# EAGLE board picotouch_grid_mpr (EAGLE 9.6.2)
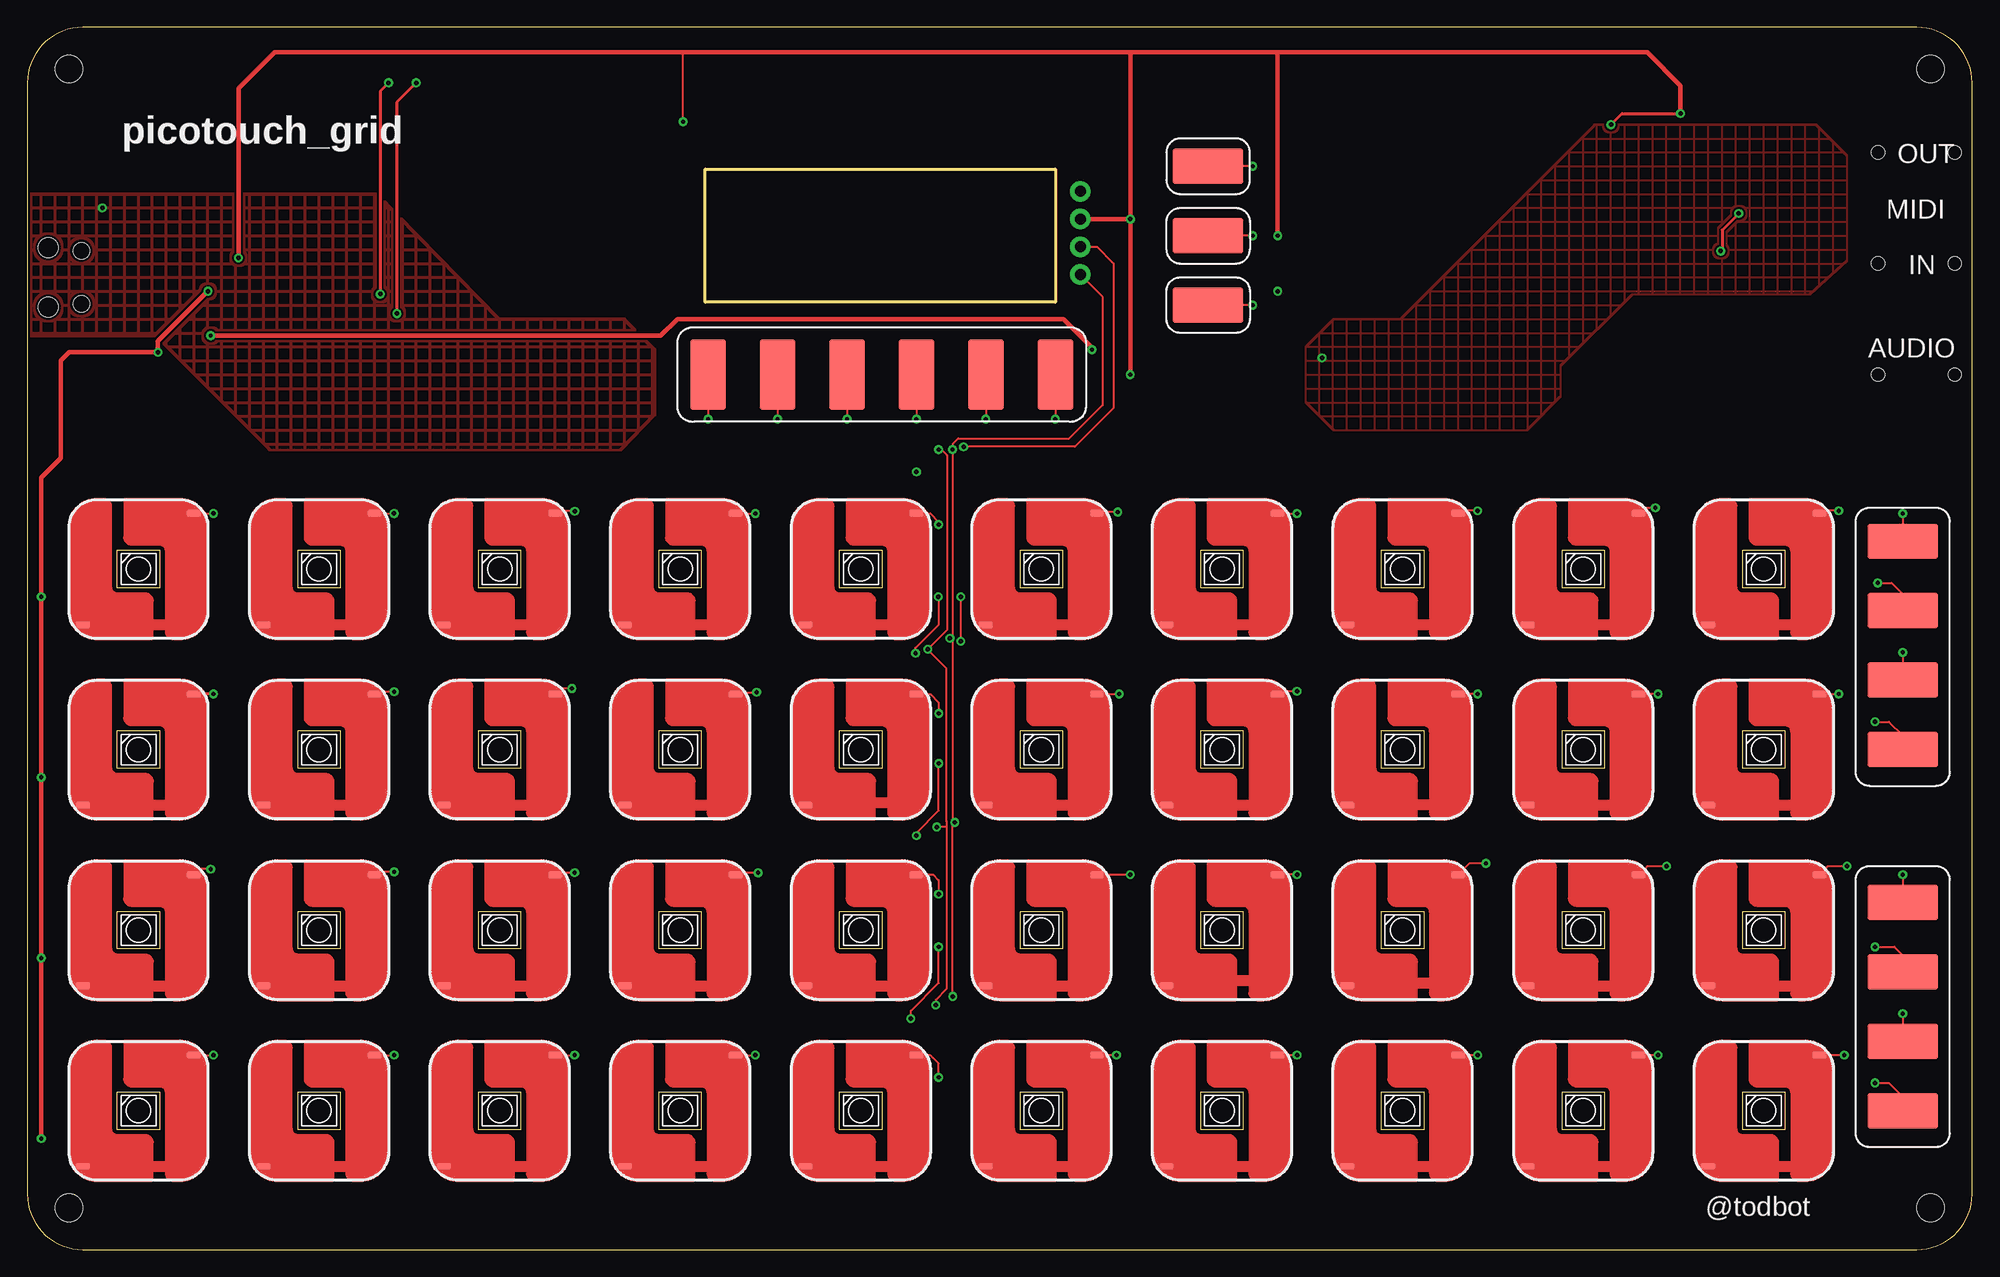
[diagram p2: board, top side]
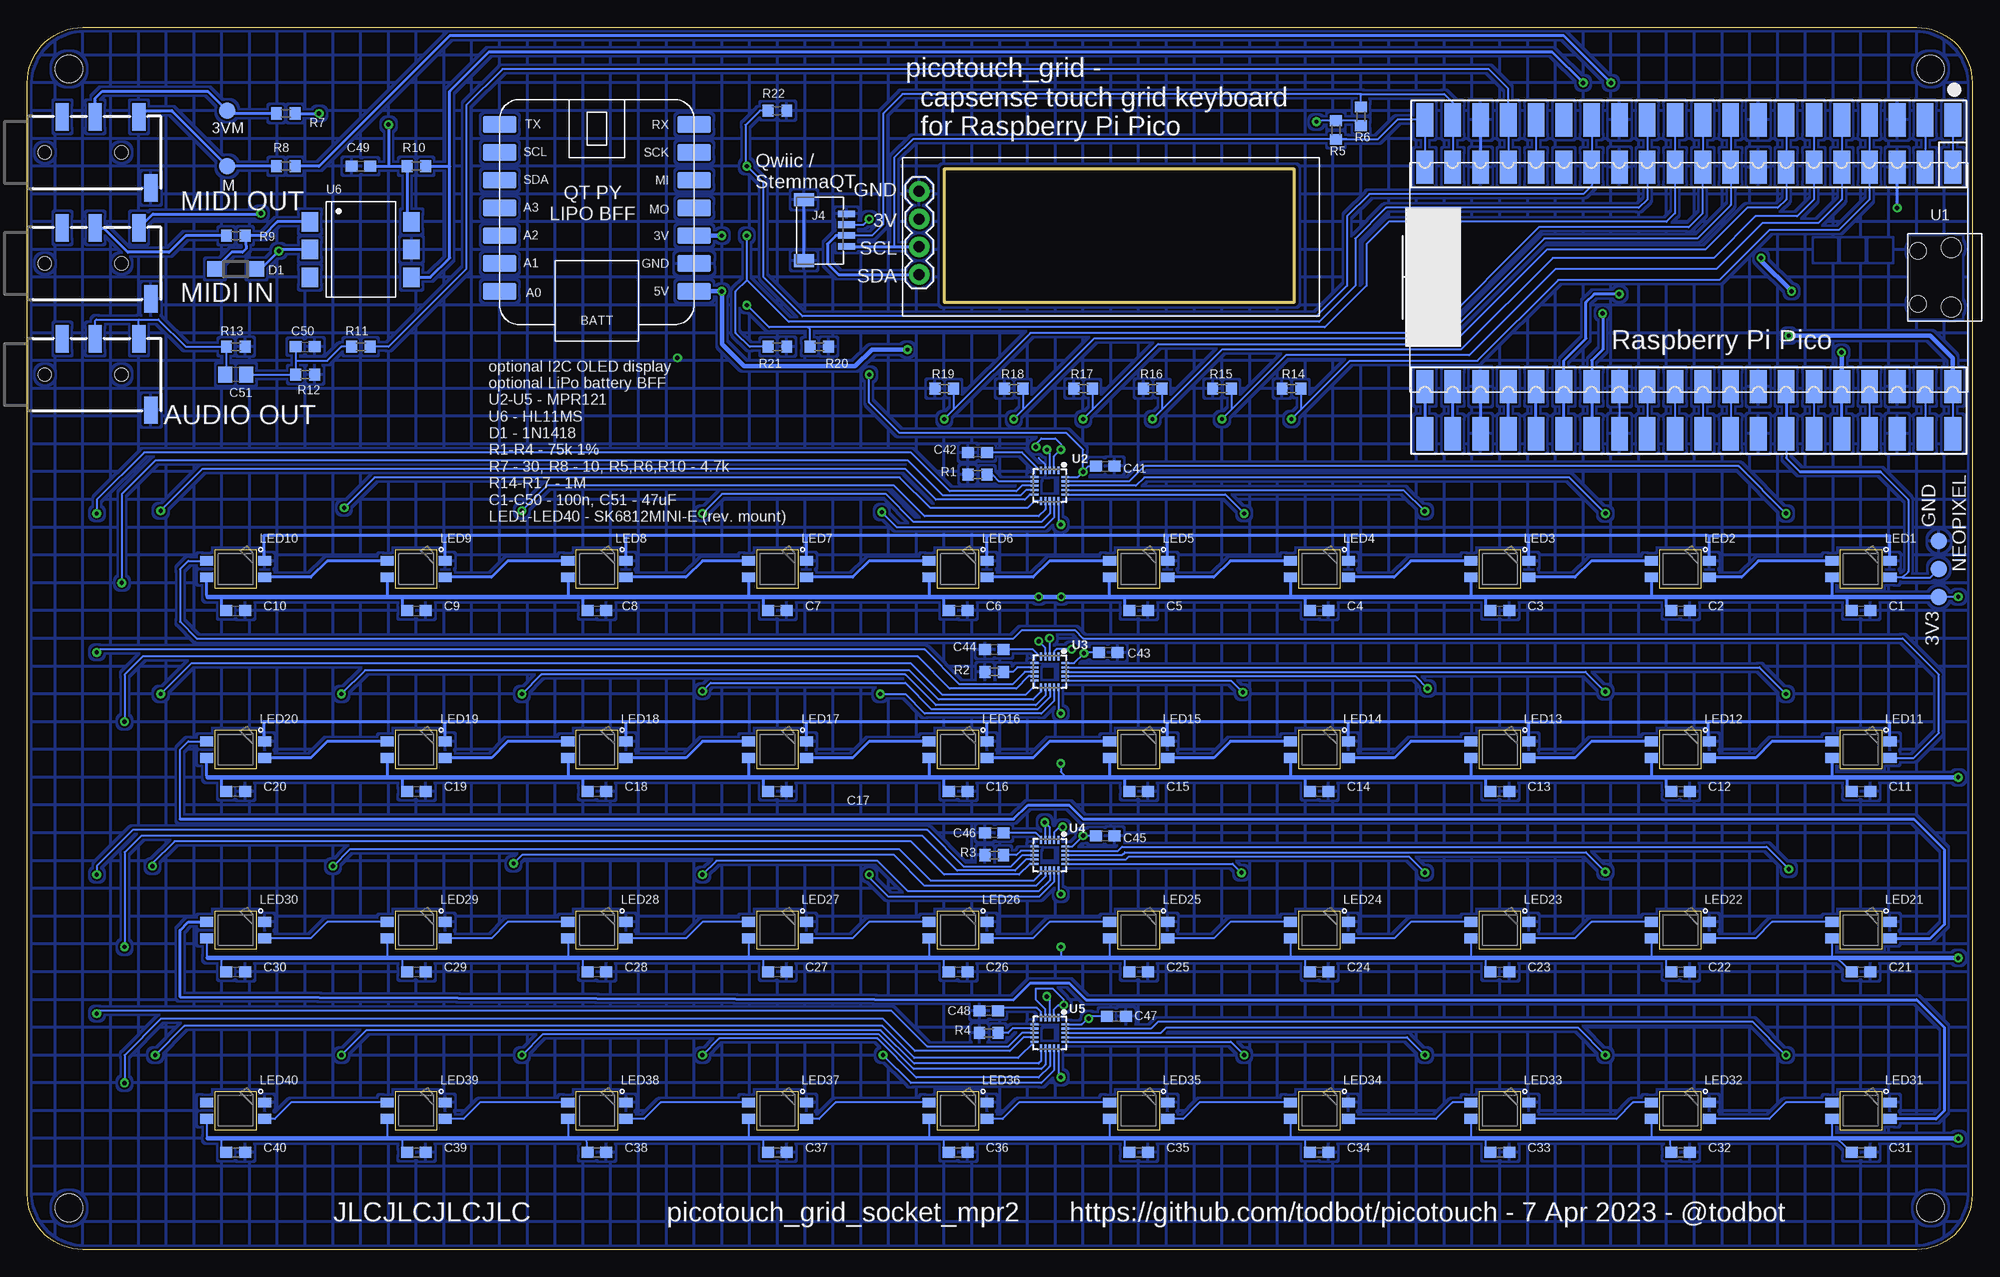
[diagram p3: board, bottom side, seen from below]

Size 177.8 x 111.76 mm. Coordinates in mm from the lower left corner, seen from the top.
Outline: 5.08,0 172.72,0 arc90 177.8,5.08 177.8,106.68 arc90 172.72,111.76 5.08,111.76 arc90 0,106.68 0,5.08 arc90 5.08,0
Outline: 61.98,98.81 93.98,98.81 93.98,86.61 61.98,86.61 61.98,98.81
Copper layers (1*16): Top 0.035mm / dielectric 1.5mm / Bottom 0.035mm
Design rules "adafruit-mpr-hat": minimum track width 7mil, minimum drill 15.5mil, track to track 7mil, track to pad 7mil, pad to pad 7mil, via to via 8mil, smd to smd 8mil, copper to edge 10mil, drill to drill 8mil, minimum pad ring 10mil, minimum via ring 8mil, stop-mask expansion 2mil, vias tented up to drill 20mil, thermal gap 10mil
Holes 2.54 mm at 3.81,107.95 173.99,107.95 173.99,3.81 3.81,3.81

## Footprints (pad centres in the part's own frame; a part is rotated, then mirrored left to right if it is on the bottom)
TP15R = smd 1.5 x 1.5: TP 0,0
C0603 = smd 1.1 x 1: 1 -0.85,0; 2 0.85,0
C0805 = smd 1.3 x 1.5: 1 -0.95,0; 2 0.95,0
SOD123 = smd 1.4 x 1.4: A 1.9,0; C -1.9,0
1X04 = drill 1.016 pad 1.88: 1 0,0; 2 2.54,0; 3 5.08,0; 4 7.62,0
PJ-320D_SPARKFUN = smd 1.2 x 2.5: EARTH 11.3,-3.25; RING1 6.2,3.25; RING2 3.2,3.25; TIP 10.2,3.25 | hole 1.2: 1.6,0; 8.6,0
JST_SH4 = smd 0.6 x 1.55: 1 -1.5,2.006; 2 -0.5,2.006; 3 0.5,2.006; 4 1.5,2.006 | smd 1.2 x 1.8: MT1 -2.8,-1.894; MT2 2.8,-1.894
TOUCHPAD_KEY_0.5IN_LEDHOLE = smd 1.27 x 0.635: T1 -5.08,-5.08; T2 5.08,5.08
MICROBUILDER_NEO3535_REVERSE = smd 1.2 x 0.9 bottom: 1-VDD 2.65,-0.75; 2-DOUT 2.65,0.75; 3-GND -2.65,0.75; 4-DIN -2.65,-0.75
R0603 = smd 1 x 1.1: 1 -0.85,0; 2 0.85,0
TOUCHPADB = smd 6.452 x 3.251: TP 0,0
PICO-PKG-DUALSMD = smd 3.048 x 1.524: 1 -10.078,24.142; 1' -14.396,24.142; 2 -10.078,21.602; 2' -14.396,21.602; 3 -10.078,19.062; 3' -14.396,19.062; 4 -10.078,16.522; 4' -14.396,16.522; 5 -10.078,13.982; 5' -14.396,13.982; 6 -10.078,11.442; 6' -14.396,11.442; 7 -10.078,8.902; 7' -14.396,8.902; 8 -10.078,6.362; 8' -14.396,6.362; 9 -10.078,3.822; 9' -14.396,3.822; 10 -10.078,1.282; 10' -14.396,1.282; 11 -10.078,-1.258; 11' -14.396,-1.258; 12 -10.078,-3.798; 12' -14.396,-3.798; 13 -10.078,-6.338; 13' -14.396,-6.338; 14 -10.078,-8.878; 14' -14.396,-8.878; 15 -10.078,-11.418; 15' -14.396,-11.418; 16 -10.078,-13.958; 16' -14.396,-13.958; 17 -10.078,-16.498; 17' -14.396,-16.498; 18 -10.078,-19.038; 18' -14.396,-19.038; 19 -10.078,-21.578; 19' -14.396,-21.578; 20 -10.078,-24.118; 20' -14.396,-24.118; 21 9.988,-24.118; 21' 14.306,-24.118; 22 9.988,-21.578; 22' 14.306,-21.578; 23 9.988,-19.038; 23' 14.306,-19.038; 24 9.988,-16.498; 24' 14.306,-16.498; 25 9.988,-13.958; 25' 14.306,-13.958; 26 9.988,-11.418; 26' 14.306,-11.418; 27 9.988,-8.878; 27' 14.306,-8.878; 28 9.988,-6.338; 28' 14.306,-6.338; 29 9.988,-3.798; 29' 14.306,-3.798; 30 9.988,-1.258; 30' 14.306,-1.258; 31 9.988,1.282; 31' 14.306,1.282; 32 9.988,3.822; 32' 14.306,3.822; 33 9.988,6.362; 33' 14.306,6.362; 34 9.988,8.902; 34' 14.306,8.902; 35 9.988,11.442; 35' 14.306,11.442; 36 9.988,13.982; 36' 14.306,13.982; 37 9.988,16.522; 37' 14.306,16.522; 38 9.988,19.062; 38' 14.306,19.062; 39 9.988,21.602; 39' 14.306,21.602; 40 9.988,24.142; 40' 14.306,24.142 | hole 1.8: -2.725,24; 2.725,24 | hole 1.5: -2.425,20.97; 2.425,20.97
QFN20_3MM_NOTHERMAL = smd 0.7 x 0.2: 1 -1.4,0.8; 2 -1.4,0.4; 3 -1.4,0; 4 -1.4,-0.4; 5 -1.4,-0.8; 11 1.4,-0.8; 12 1.4,-0.4; 13 1.4,0; 14 1.4,0.4; 15 1.4,0.8 | smd 0.2 x 0.7: 6 -0.8,-1.4; 7 -0.4,-1.4; 8 0,-1.4; 9 0.4,-1.4; 10 0.8,-1.4; 16 0.8,1.4; 17 0.4,1.4; 18 0,1.4; 19 -0.4,1.4; 20 -0.8,1.4
DIL6-SMD = smd 1.78 x 1.52: 1 -2.54,-4.645; 2 0,-4.645; 3 2.54,-4.645; 4 2.54,4.645; 5 0,4.645; 6 -2.54,4.645
ADAFRUIT_QTPY_BFF_LIPO = smd 3.048 x 1.524: 3V -8.89,2.54; 5V -8.89,7.62; A0 8.89,7.62; A1 8.89,5.08; A2 8.89,2.54; A3 8.89,0; GND -8.89,5.08; MI -8.89,-2.54; MO -8.89,0; RX -8.89,-7.62; SCK -8.89,-5.08; SCL 8.89,-5.08; SDA 8.89,-2.54; TX 8.89,-7.62

## Placement (x,y rotation side)
3V3  TPTP15R  [TP15R]  3.05,59.69 0 bottom
3VM  TPTP15R  [TP15R]  159.51,104.14 180 bottom
C1  100n  [C0603]  10.16,58.42 0 bottom
C2  100n  [C0603]  26.67,58.42 0 bottom
C3  100n  [C0603]  43.18,58.42 0 bottom
C4  100n  [C0603]  59.69,58.42 0 bottom
C5  100n  [C0603]  76.2,58.42 0 bottom
C6  100n  [C0603]  92.71,58.42 0 bottom
C7  100n  [C0603]  109.22,58.42 0 bottom
C8  100n  [C0603]  125.73,58.42 0 bottom
C9  100n  [C0603]  142.24,58.42 0 bottom
C10  100n  [C0603]  158.75,58.42 0 bottom
C11  100n  [C0603]  10.16,41.91 0 bottom
C12  100n  [C0603]  26.67,41.91 0 bottom
C13  100n  [C0603]  43.18,41.91 0 bottom
C14  100n  [C0603]  59.69,41.91 0 bottom
C15  100n  [C0603]  76.2,41.91 0 bottom
C16  100n  [C0603]  92.71,41.91 0 bottom
C17  100n  [C0603]  109.22,41.91 0 bottom
C18  100n  [C0603]  125.73,41.91 0 bottom
C19  100n  [C0603]  142.24,41.91 0 bottom
C20  100n  [C0603]  158.75,41.91 0 bottom
C21  100n  [C0603]  10.16,25.4 0 bottom
C22  100n  [C0603]  26.67,25.4 0 bottom
C23  100n  [C0603]  43.18,25.4 0 bottom
C24  100n  [C0603]  59.69,25.4 0 bottom
C25  100n  [C0603]  76.2,25.4 0 bottom
C26  100n  [C0603]  92.71,25.4 0 bottom
C27  100n  [C0603]  109.22,25.4 0 bottom
C28  100n  [C0603]  125.73,25.4 0 bottom
C29  100n  [C0603]  142.24,25.4 0 bottom
C30  100n  [C0603]  158.75,25.4 0 bottom
C31  100n  [C0603]  10.16,8.89 0 bottom
C32  100n  [C0603]  26.67,8.89 0 bottom
C33  100n  [C0603]  43.18,8.89 0 bottom
C34  100n  [C0603]  59.69,8.89 0 bottom
C35  100n  [C0603]  76.2,8.89 0 bottom
C36  100n  [C0603]  92.71,8.89 0 bottom
C37  100n  [C0603]  109.22,8.89 0 bottom
C38  100n  [C0603]  125.73,8.89 0 bottom
C39  100n  [C0603]  142.24,8.89 0 bottom
C40  100n  [C0603]  158.75,8.89 0 bottom
C41  100n  [C0603]  79.25,71.63 0 bottom
C42  100n  [C0603]  90.93,72.9 180 bottom
C43  100n  [C0603]  78.99,54.61 0 bottom
C44  100n  [C0603]  89.41,54.86 180 bottom
C45  100n  [C0603]  79.25,37.85 0 bottom
C46  100n  [C0603]  89.41,38.1 180 bottom
C47  100n  [C0603]  78.23,21.34 0 bottom
C48  100n  [C0603]  89.92,21.84 180 bottom
C49  100n  [C0603]  147.32,99.06 180 bottom
C50  100n  [C0603]  152.4,82.55 0 bottom
C51  47uF  [C0805]  158.75,80.01 180 bottom
D1  1N4148  [SOD123]  158.75,89.66 0 bottom
DISP1  [1X04]  96.27,96.77 270 bottom
GND  TPTP15R  [TP15R]  3.05,64.77 0 bottom
J1  AUDIO-JACK-TRRS  [PJ-320D_SPARKFUN]  177.8,100.33 0 bottom
J2  AUDIO-JACK-TRRS  [PJ-320D_SPARKFUN]  177.8,90.17 0 bottom
J3  AUDIO-JACK-TRRS  [PJ-320D_SPARKFUN]  177.8,80.01 0 bottom
J4  STEMMA_I2C_QT  [JST_SH4]  104.9,93.22 270 bottom
K1  TOUCHKEYH  [TOUCHPAD_KEY_0.5IN_LEDHOLE]  10.16,62.23 0 top
K2  TOUCHKEYH  [TOUCHPAD_KEY_0.5IN_LEDHOLE]  26.67,62.23 0 top
K3  TOUCHKEYH  [TOUCHPAD_KEY_0.5IN_LEDHOLE]  43.18,62.23 0 top
K4  TOUCHKEYH  [TOUCHPAD_KEY_0.5IN_LEDHOLE]  59.69,62.23 0 top
K5  TOUCHKEYH  [TOUCHPAD_KEY_0.5IN_LEDHOLE]  76.2,62.23 0 top
K6  TOUCHKEYH  [TOUCHPAD_KEY_0.5IN_LEDHOLE]  92.71,62.23 0 top
K7  TOUCHKEYH  [TOUCHPAD_KEY_0.5IN_LEDHOLE]  109.22,62.23 0 top
K8  TOUCHKEYH  [TOUCHPAD_KEY_0.5IN_LEDHOLE]  125.73,62.23 0 top
K9  TOUCHKEYH  [TOUCHPAD_KEY_0.5IN_LEDHOLE]  142.24,62.23 0 top
K10  TOUCHKEYH  [TOUCHPAD_KEY_0.5IN_LEDHOLE]  158.75,62.23 0 top
K11  TOUCHKEYH  [TOUCHPAD_KEY_0.5IN_LEDHOLE]  10.16,45.72 0 top
K12  TOUCHKEYH  [TOUCHPAD_KEY_0.5IN_LEDHOLE]  26.67,45.72 0 top
K13  TOUCHKEYH  [TOUCHPAD_KEY_0.5IN_LEDHOLE]  43.18,45.72 0 top
K14  TOUCHKEYH  [TOUCHPAD_KEY_0.5IN_LEDHOLE]  59.69,45.72 0 top
K15  TOUCHKEYH  [TOUCHPAD_KEY_0.5IN_LEDHOLE]  76.2,45.72 0 top
K16  TOUCHKEYH  [TOUCHPAD_KEY_0.5IN_LEDHOLE]  92.71,45.72 0 top
K17  TOUCHKEYH  [TOUCHPAD_KEY_0.5IN_LEDHOLE]  109.22,45.72 0 top
K18  TOUCHKEYH  [TOUCHPAD_KEY_0.5IN_LEDHOLE]  125.73,45.72 0 top
K19  TOUCHKEYH  [TOUCHPAD_KEY_0.5IN_LEDHOLE]  142.24,45.72 0 top
K20  TOUCHKEYH  [TOUCHPAD_KEY_0.5IN_LEDHOLE]  158.75,45.72 0 top
K21  TOUCHKEYH  [TOUCHPAD_KEY_0.5IN_LEDHOLE]  10.16,29.21 0 top
K22  TOUCHKEYH  [TOUCHPAD_KEY_0.5IN_LEDHOLE]  26.67,29.21 0 top
K23  TOUCHKEYH  [TOUCHPAD_KEY_0.5IN_LEDHOLE]  43.18,29.21 0 top
K24  TOUCHKEYH  [TOUCHPAD_KEY_0.5IN_LEDHOLE]  59.69,29.21 0 top
K25  TOUCHKEYH  [TOUCHPAD_KEY_0.5IN_LEDHOLE]  76.2,29.21 0 top
K26  TOUCHKEYH  [TOUCHPAD_KEY_0.5IN_LEDHOLE]  92.71,29.21 0 top
K27  TOUCHKEYH  [TOUCHPAD_KEY_0.5IN_LEDHOLE]  109.22,29.21 0 top
K28  TOUCHKEYH  [TOUCHPAD_KEY_0.5IN_LEDHOLE]  125.73,29.21 0 top
K29  TOUCHKEYH  [TOUCHPAD_KEY_0.5IN_LEDHOLE]  142.24,29.21 0 top
K30  TOUCHKEYH  [TOUCHPAD_KEY_0.5IN_LEDHOLE]  158.75,29.21 0 top
K31  TOUCHKEYH  [TOUCHPAD_KEY_0.5IN_LEDHOLE]  10.16,12.7 0 top
K32  TOUCHKEYH  [TOUCHPAD_KEY_0.5IN_LEDHOLE]  26.67,12.7 0 top
K33  TOUCHKEYH  [TOUCHPAD_KEY_0.5IN_LEDHOLE]  43.18,12.7 0 top
K34  TOUCHKEYH  [TOUCHPAD_KEY_0.5IN_LEDHOLE]  59.69,12.7 0 top
K35  TOUCHKEYH  [TOUCHPAD_KEY_0.5IN_LEDHOLE]  76.2,12.7 0 top
K36  TOUCHKEYH  [TOUCHPAD_KEY_0.5IN_LEDHOLE]  92.71,12.7 0 top
K37  TOUCHKEYH  [TOUCHPAD_KEY_0.5IN_LEDHOLE]  109.22,12.7 0 top
K38  TOUCHKEYH  [TOUCHPAD_KEY_0.5IN_LEDHOLE]  125.73,12.7 0 top
K39  TOUCHKEYH  [TOUCHPAD_KEY_0.5IN_LEDHOLE]  142.24,12.7 0 top
K40  TOUCHKEYH  [TOUCHPAD_KEY_0.5IN_LEDHOLE]  158.75,12.7 0 top
LED1  MICROBUILDER_WS2812B_SK6812E  [MICROBUILDER_NEO3535_REVERSE]  10.16,62.23 0 top
LED2  MICROBUILDER_WS2812B_SK6812E  [MICROBUILDER_NEO3535_REVERSE]  26.67,62.23 0 top
LED3  MICROBUILDER_WS2812B_SK6812E  [MICROBUILDER_NEO3535_REVERSE]  43.18,62.23 0 top
LED4  MICROBUILDER_WS2812B_SK6812E  [MICROBUILDER_NEO3535_REVERSE]  59.69,62.23 0 top
LED5  MICROBUILDER_WS2812B_SK6812E  [MICROBUILDER_NEO3535_REVERSE]  76.2,62.23 0 top
LED6  MICROBUILDER_WS2812B_SK6812E  [MICROBUILDER_NEO3535_REVERSE]  92.71,62.23 0 top
LED7  MICROBUILDER_WS2812B_SK6812E  [MICROBUILDER_NEO3535_REVERSE]  109.22,62.23 0 top
LED8  MICROBUILDER_WS2812B_SK6812E  [MICROBUILDER_NEO3535_REVERSE]  125.73,62.23 0 top
LED9  MICROBUILDER_WS2812B_SK6812E  [MICROBUILDER_NEO3535_REVERSE]  142.24,62.23 0 top
LED10  MICROBUILDER_WS2812B_SK6812E  [MICROBUILDER_NEO3535_REVERSE]  158.75,62.23 0 top
LED11  MICROBUILDER_WS2812B_SK6812E  [MICROBUILDER_NEO3535_REVERSE]  10.16,45.72 0 top
LED12  MICROBUILDER_WS2812B_SK6812E  [MICROBUILDER_NEO3535_REVERSE]  26.67,45.72 0 top
LED13  MICROBUILDER_WS2812B_SK6812E  [MICROBUILDER_NEO3535_REVERSE]  43.18,45.72 0 top
LED14  MICROBUILDER_WS2812B_SK6812E  [MICROBUILDER_NEO3535_REVERSE]  59.69,45.72 0 top
LED15  MICROBUILDER_WS2812B_SK6812E  [MICROBUILDER_NEO3535_REVERSE]  76.2,45.72 0 top
LED16  MICROBUILDER_WS2812B_SK6812E  [MICROBUILDER_NEO3535_REVERSE]  92.71,45.72 0 top
LED17  MICROBUILDER_WS2812B_SK6812E  [MICROBUILDER_NEO3535_REVERSE]  109.22,45.72 0 top
LED18  MICROBUILDER_WS2812B_SK6812E  [MICROBUILDER_NEO3535_REVERSE]  125.73,45.72 0 top
LED19  MICROBUILDER_WS2812B_SK6812E  [MICROBUILDER_NEO3535_REVERSE]  142.24,45.72 0 top
LED20  MICROBUILDER_WS2812B_SK6812E  [MICROBUILDER_NEO3535_REVERSE]  158.75,45.72 0 top
LED21  MICROBUILDER_WS2812B_SK6812E  [MICROBUILDER_NEO3535_REVERSE]  10.16,29.21 0 top
LED22  MICROBUILDER_WS2812B_SK6812E  [MICROBUILDER_NEO3535_REVERSE]  26.67,29.21 0 top
LED23  MICROBUILDER_WS2812B_SK6812E  [MICROBUILDER_NEO3535_REVERSE]  43.18,29.21 0 top
LED24  MICROBUILDER_WS2812B_SK6812E  [MICROBUILDER_NEO3535_REVERSE]  59.69,29.21 0 top
LED25  MICROBUILDER_WS2812B_SK6812E  [MICROBUILDER_NEO3535_REVERSE]  76.2,29.21 0 top
LED26  MICROBUILDER_WS2812B_SK6812E  [MICROBUILDER_NEO3535_REVERSE]  92.71,29.21 0 top
LED27  MICROBUILDER_WS2812B_SK6812E  [MICROBUILDER_NEO3535_REVERSE]  109.22,29.21 0 top
LED28  MICROBUILDER_WS2812B_SK6812E  [MICROBUILDER_NEO3535_REVERSE]  125.73,29.21 0 top
LED29  MICROBUILDER_WS2812B_SK6812E  [MICROBUILDER_NEO3535_REVERSE]  142.24,29.21 0 top
LED30  MICROBUILDER_WS2812B_SK6812E  [MICROBUILDER_NEO3535_REVERSE]  158.75,29.21 0 top
LED31  MICROBUILDER_WS2812B_SK6812E  [MICROBUILDER_NEO3535_REVERSE]  10.16,12.7 0 top
LED32  MICROBUILDER_WS2812B_SK6812E  [MICROBUILDER_NEO3535_REVERSE]  26.67,12.7 0 top
LED33  MICROBUILDER_WS2812B_SK6812E  [MICROBUILDER_NEO3535_REVERSE]  43.18,12.7 0 top
LED34  MICROBUILDER_WS2812B_SK6812E  [MICROBUILDER_NEO3535_REVERSE]  59.69,12.7 0 top
LED35  MICROBUILDER_WS2812B_SK6812E  [MICROBUILDER_NEO3535_REVERSE]  76.2,12.7 0 top
LED36  MICROBUILDER_WS2812B_SK6812E  [MICROBUILDER_NEO3535_REVERSE]  92.71,12.7 0 top
LED37  MICROBUILDER_WS2812B_SK6812E  [MICROBUILDER_NEO3535_REVERSE]  109.22,12.7 0 top
LED38  MICROBUILDER_WS2812B_SK6812E  [MICROBUILDER_NEO3535_REVERSE]  125.73,12.7 0 top
LED39  MICROBUILDER_WS2812B_SK6812E  [MICROBUILDER_NEO3535_REVERSE]  142.24,12.7 0 top
LED40  MICROBUILDER_WS2812B_SK6812E  [MICROBUILDER_NEO3535_REVERSE]  158.75,12.7 0 top
M  TPTP15R  [TP15R]  159.51,99.06 90 bottom
NEOPIXEL  TPTP15R  [TP15R]  3.05,62.23 0 bottom
R1  75k / 1%  [R0603]  90.93,70.87 0 bottom
R2  75k / 1%  [R0603]  89.41,52.83 0 bottom
R3  75k / 1%  [R0603]  89.41,36.07 0 bottom
R4  75k / 1%  [R0603]  89.92,19.81 0 bottom
R5  4.7k  [R0603]  58.17,102.36 270 bottom
R6  4.7k  [R0603]  55.88,103.63 90 bottom
R7  33  [R0603]  154.18,103.89 0 bottom
R8  10  [R0603]  154.18,99.06 0 bottom
R9  220  [R0603]  158.75,92.71 180 bottom
R10  4.7k  [R0603]  142.24,99.06 0 bottom
R11  220  [R0603]  147.32,82.55 0 bottom
R12  100  [R0603]  152.4,80.01 180 bottom
R13  1.8k  [R0603]  158.75,82.55 0 bottom
R14  1M  [R0603]  62.23,78.74 0 bottom
R15  1M  [R0603]  68.58,78.74 0 bottom
R16  1M  [R0603]  74.93,78.74 0 bottom
R17  1M  [R0603]  81.28,78.74 0 bottom
R18  1M  [R0603]  87.63,78.74 0 bottom
R19  1M  [R0603]  93.98,78.74 0 bottom
R20  1M  [R0603]  105.41,82.55 180 bottom
R21  1M  [R0603]  109.22,82.55 180 bottom
R22  1M  [R0603]  109.22,104.14 180 bottom
TP1  TOUCHPADB  [TOUCHPADB]  62.23,80.01 90 top
TP2  TOUCHPADB  [TOUCHPADB]  68.58,80.01 90 top
TP3  TOUCHPADB  [TOUCHPADB]  74.93,80.01 90 top
TP4  TOUCHPADB  [TOUCHPADB]  81.28,80.01 90 top
TP5  TOUCHPADB  [TOUCHPADB]  87.63,80.01 90 top
TP6  TOUCHPADB  [TOUCHPADB]  93.98,80.01 90 top
TP7  TOUCHPADB  [TOUCHPADB]  107.95,86.36 0 top
TP8  TOUCHPADB  [TOUCHPADB]  107.95,92.71 0 top
TP9  TOUCHPADB  [TOUCHPADB]  107.95,99.06 0 top
TP10  TOUCHPADB  [TOUCHPADB]  171.45,58.42 0 top
TP11  TOUCHPADB  [TOUCHPADB]  171.45,64.77 0 top
TP12  TOUCHPADB  [TOUCHPADB]  171.45,45.72 0 top
TP13  TOUCHPADB  [TOUCHPADB]  171.45,52.07 0 top
TP14  TOUCHPADB  [TOUCHPADB]  171.45,25.4 0 top
TP15  TOUCHPADB  [TOUCHPADB]  171.45,31.75 0 top
TP16  TOUCHPADB  [TOUCHPADB]  171.45,12.7 0 top
TP17  TOUCHPADB  [TOUCHPADB]  171.45,19.05 0 top
U1  RASPBERRY_PICO  [PICO-PKG-DUALSMD]  25.91,88.9 270 bottom
U2  MPR121  [QFN20_3MM_NOTHERMAL]  84.33,69.85 270 bottom
U3  MPR121  [QFN20_3MM_NOTHERMAL]  84.33,52.83 270 bottom
U4  MPR121  [QFN20_3MM_NOTHERMAL]  84.33,36.07 270 bottom
U5  MPR121  [QFN20_3MM_NOTHERMAL]  84.33,19.81 270 bottom
U6  H11L1MS  [DIL6-SMD]  147.32,91.44 270 bottom
U7  ADAFRUIT_QTPY_BFF  [ADAFRUIT_QTPY_BFF_LIPO]  125.73,95.25 180 bottom

## Tracks (layer width: path | path; a pad name or v marks a point on that pad's centre or on a via)
+3V3  (via drill 0.39, 0.41)
  Top 0.203: v81.2,54.53 81.2,55.01 83.28,57.1 v83.28,59.69 | v81.28,37.85 81.28,38.1 83.32,40.14 v83.32,44.45 | v85.34,55.63 v85.34,59.69 | v80.77,21.12 80.77,21.84 83.31,24.38 v83.31,27.69 | v59.94,103.12 59.94,109.47
  Top 0.254: v151.13,103.89 145.8,103.89 v144.78,102.87
  Top 0.406: v1.27,10.16 v1.27,26.67 v1.27,43.18 v1.27,59.69 1.27,70.61 3.05,72.39 3.05,81.28 3.81,82.04 v11.94,82.04 11.94,83.06 v16.51,87.63 | 100.84,109.47 59.94,109.47 22.61,109.47 19.3,106.17 v19.3,90.68 | v151.13,103.89 151.13,106.43 148.08,109.47 114.3,109.47 | 114.3,109.47 100.84,109.47 | v100.84,94.23 97.79,94.23 DISP1.2 | v100.84,94.23 100.84,109.47 | v100.84,94.23 v100.84,80.01 | v114.3,92.71 114.3,109.47
  Bottom 0.203: C21.1 12.38,26.67 12.7,26.67 12.81,26.78 LED21.1-VDD | C30.1 160.02,25.72 160.02,26.67 | LED30.1-VDD 161.4,26.78 161.29,26.67 | LED29.1-VDD 144.89,26.78 144.78,26.67 | C29.1 143.51,25.72 143.51,26.67 | LED28.1-VDD 128.38,26.78 128.27,26.67 | C28.1 127,25.72 127,26.67 | C27.1 110.49,25.72 110.49,26.67 | LED27.1-VDD 111.87,26.78 111.76,26.67 | C26.1 93.98,25.72 93.98,26.67 | LED26.1-VDD 95.36,26.78 95.25,26.67 | C25.1 77.47,25.72 77.47,26.67 | LED25.1-VDD 78.85,26.78 78.74,26.67 | C24.1 60.96,25.72 60.96,26.67 | LED24.1-VDD 62.34,26.78 62.23,26.67 | C23.1 44.45,25.72 44.45,26.67 | LED23.1-VDD 45.83,26.78 45.72,26.67 | C22.1 27.94,25.72 27.94,26.67 | LED22.1-VDD 29.32,26.78 29.21,26.67 | C31.1 12.38,10.16 12.7,10.16 12.81,10.27 LED31.1-VDD | LED32.1-VDD 29.32,10.27 29.21,10.16 | LED33.1-VDD 45.83,10.27 45.72,10.16 | C33.1 44.45,9.21 44.45,10.16 | C32.1 27.62,10.16 | C34.1 60.96,9.21 60.96,10.16 | LED34.1-VDD 62.34,10.27 62.23,10.16 | C35.1 77.47,9.21 77.47,10.16 | LED35.1-VDD 78.85,10.27 78.74,10.16 | C36.1 93.98,9.21 93.98,10.16 | LED36.1-VDD 95.36,10.27 95.25,10.16 | C37.1 110.49,9.21 110.49,10.16 | LED37.1-VDD 111.87,10.27 111.76,10.16 | C38.1 126.68,10.16 | LED38.1-VDD 128.38,10.27 128.27,10.16 | C39.1 143.51,9.21 143.51,10.16 | LED39.1-VDD 144.89,10.27 144.78,10.16 | C40.1 160.02,9.21 160.02,10.16 | LED40.1-VDD 161.4,10.27 161.29,10.16 | J4.2 101.35,93.72 v100.84,94.23 | v1.27,59.69 3V3.TP | U3.20 82.09,53.63 v81.2,54.53 81.11,54.61 C43.1 | U4.20 82.26,36.87 v81.28,37.85 C45.1 | U3.4 84.73,55.01 v85.34,55.63 | v83.32,44.45 83.32,43.7 82.8,43.18 | U2.20 81.75,70.65 v81.28,71.12 | C41.1 80.77,71.63 v81.28,71.12
  Bottom 0.203: U5.20 81.4,20.61 80.9,21.12 v80.77,21.12 80.52,21.37 79.12,21.37 C47.1 | v83.31,27.69 83.31,26.67 | R6.1 56.31,103.21 R5.1 59.86,103.21 v59.94,103.12 | v81.28,71.12 81.28,73.15 82.8,74.68 98.04,74.68 100.84,77.47 v100.84,80.01
  Bottom 0.254: LED6.1-VDD 95.36,59.8 95.25,59.69 | C6.1 93.98,58.74 93.98,59.69 | C5.1 77.47,58.74 77.47,59.69 | LED5.1-VDD 78.85,59.8 78.74,59.69 | LED4.1-VDD 62.34,59.8 62.23,59.69 | C4.1 60.96,58.74 60.96,59.69 | C3.1 44.45,58.74 44.45,59.69 | LED3.1-VDD 45.83,59.8 45.72,59.69 | C2.1 27.94,58.74 27.94,59.69 | LED2.1-VDD 29.32,59.8 29.21,59.69 | C1.1 11.43,58.74 11.43,59.69 12.7,59.69 12.81,59.8 LED1.1-VDD | 161.29,43.18 161.4,43.29 LED20.1-VDD | C20.1 160.02,42.23 160.02,43.18 | 161.29,59.69 161.4,59.8 LED10.1-VDD | C10.1 160.02,58.74 160.02,59.69 | C9.1 143.51,58.74 143.51,59.69 | LED9.1-VDD 144.89,59.8 144.78,59.69 | LED8.1-VDD 128.38,59.8 128.27,59.69 | C8.1 127,58.74 127,59.69 | C7.1 110.49,58.74 110.49,59.69 | LED7.1-VDD 111.87,59.8 111.76,59.69 | LED11.1-VDD 12.81,43.29 12.7,43.18 | LED12.1-VDD 29.32,43.29 29.21,43.18 | LED19.1-VDD 144.89,43.29 144.78,43.18 | C19.1 143.51,42.23 143.51,43.18 | C18.1 127,42.23 127,43.18 | LED18.1-VDD 128.38,43.29 128.27,43.18 | LED17.1-VDD 111.87,43.29 111.76,43.18 | C17.1 110.49,42.23 110.49,43.18 | C16.1 93.98,42.23 93.98,43.18 | LED16.1-VDD 95.36,43.29 95.25,43.18 | LED15.1-VDD 78.85,43.29 78.74,43.18 | C15.1 77.47,42.23 77.47,43.18 | LED14.1-VDD 62.34,43.29 62.23,43.18 | C14.1 60.96,42.23 60.96,43.18 | LED13.1-VDD 45.83,43.29 45.72,43.18 | C13.1 44.45,42.23 44.45,43.18 | C12.1 27.94,42.23 27.94,43.18 | C11.1 11.43,42.23 11.43,43.18 | R7.2 v151.13,103.89 | U1.36' U1.36 | U6.6 143.09,94.39 R10.1 144.78,99.06 | C49.1 144.78,99.06 | v144.78,102.87 144.78,99.06
  Bottom 0.406: 161.29,59.69 160.02,59.69 144.78,59.69 143.51,59.69 128.27,59.69 127,59.69 111.76,59.69 110.49,59.69 95.25,59.69 93.98,59.69 v85.34,59.69 v83.28,59.69 78.74,59.69 77.47,59.69 62.23,59.69 60.96,59.69 45.72,59.69 44.45,59.69 29.21,59.69 27.94,59.69 12.7,59.69 3V3.TP | 161.29,43.18 160.02,43.18 144.78,43.18 143.51,43.18 128.27,43.18 127,43.18 111.76,43.18 110.49,43.18 95.25,43.18 93.98,43.18 82.8,43.18 78.74,43.18 77.47,43.18 62.23,43.18 60.96,43.18 45.72,43.18 44.45,43.18 29.21,43.18 27.94,43.18 12.7,43.18 11.43,43.18 v1.27,43.18 | 161.29,26.67 160.02,26.67 144.78,26.67 143.51,26.67 128.27,26.67 127,26.67 111.76,26.67 110.49,26.67 95.25,26.67 93.98,26.67 83.31,26.67 78.74,26.67 77.47,26.67 62.23,26.67 60.96,26.67 45.72,26.67 44.45,26.67 29.21,26.67 27.94,26.67 12.7,26.67 v1.27,26.67 | 161.29,10.16 160.02,10.16 144.78,10.16 143.51,10.16 128.27,10.16 126.68,10.16 111.76,10.16 110.49,10.16 95.25,10.16 93.98,10.16 78.74,10.16 77.47,10.16 62.23,10.16 60.96,10.16 45.72,10.16 44.45,10.16 29.21,10.16 27.62,10.16 12.7,10.16 v1.27,10.16 | U1.36 11.93,82.03 v11.94,82.04 | U7.3V v114.3,92.71 | v19.3,90.68 19.3,90.42 v16.51,87.63
+5V  (via drill 0.39)
  Top 0.406: v16.76,83.57 57.91,83.57 59.44,85.09 94.74,85.09 97.34,82.49 v97.34,82.3
  Bottom 0.203: U1.40 U1.40'
  Bottom 0.406: U1.40 1.77,81.52 3.81,83.57 v16.76,83.57 | U7.5V v114.3,87.63 114.3,82.8 112.27,80.77 102.11,80.77 100.58,82.3 v97.34,82.3
AUDIO_OUT
  Bottom 0.203: J3.RING1 171.6,84.94 171.49,85.05 167.6,85.05 | J3.TIP 167.6,85.05 | 167.6,85.05 165.82,85.05 163.32,82.55 R13.1 159.6,80.11 C51.2
GND  (via drill 0.39, 0.41)
  Bottom 0.203: U2.4 84.73,71.77 85.34,72.39 | U1.28 U1.28'
  Bottom 0.254: 24.13,65.28 40.64,65.28 | 40.64,65.28 57.15,65.28 | 57.15,65.28 73.66,65.28 | 73.66,65.28 90.17,65.28 | 90.17,65.28 106.68,65.28 | 106.68,65.28 123.19,65.28 | 123.19,65.28 139.7,65.28 | 139.7,65.28 156.21,65.28 156.21,63.09 LED10.3-GND | LED6.3-GND 90.06,65.17 90.17,65.28 | LED5.3-GND 73.55,65.17 73.66,65.28 | LED4.3-GND 57.04,65.17 57.15,65.28 | LED3.3-GND 40.53,65.17 40.64,65.28 | LED2.3-GND 24.02,65.17 24.13,65.28 | LED1.3-GND 7.51,65.28 24.13,65.28 | LED9.3-GND 139.59,65.17 139.7,65.28 | LED8.3-GND 123.08,65.17 123.19,65.28 | LED7.3-GND 106.57,65.17 106.68,65.28 | 40.64,48.26 24.13,48.26 | 40.64,48.26 57.15,48.26 | 57.15,48.26 73.66,48.26 | 73.66,48.26 90.17,48.26 | 90.17,48.26 106.68,48.26 | 106.68,48.26 123.19,48.26 | 123.19,48.26 139.7,48.26 | 139.7,48.26 156.21,48.26 156.21,46.58 LED20.3-GND | LED19.3-GND 139.59,48.15 139.7,48.26 | LED18.3-GND 123.08,48.15 123.19,48.26 | LED17.3-GND 106.57,48.15 106.68,48.26 | LED16.3-GND 90.06,48.15 90.17,48.26 | LED15.3-GND 73.55,48.15 73.66,48.26 | LED14.3-GND 57.04,48.15 57.15,48.26 | LED13.3-GND 40.53,48.15 40.64,48.26 | LED12.3-GND 24.13,46.58 24.13,48.26 | 24.13,48.26 7.62,48.26 7.51,48.15 LED11.3-GND | J4.MT2 J4.MT1 | U1.23 U1.23' | U1.18' U1.18 | v6.86,95.25 6.86,98.97 U1.3
  other vias: 118.36,81.53
  pour Bottom (hatched): -1.01,-6.35 182.88,-6.35 182.88,112.92 -1.01,112.92
  pour Top (hatched): 57.4,82.3 54.61,85.09 43.18,85.09 32,96.52 -2.29,96.52 -2.54,96.27 -2.54,83.57 11.68,83.57 22.1,73.15 54.32,73.15 57.4,76.34
  pour Top (hatched): 116.84,82.55 116.84,77.47 119.38,74.93 137.16,74.93 140.21,77.98 140.21,80.79 146.83,87.38 163.07,87.38 166.37,90.4 166.37,100.08 163.58,102.87 143.26,102.87 125.48,85.09 119.38,85.09
MIDI_IN  (via drill 0.41)
  Top 0.254: v35.56,106.68 33.78,104.9 v33.78,85.6
  Bottom 0.254: 139.19,99.06 139.19,90.68 140.97,88.9 U6.4 | 139.19,99.06 139.19,105.92 135.59,109.53 38.41,109.53 v35.56,106.68 | v33.78,85.6 33.78,82.3 34.79,81.29 U1.27 U1.27' | R10.2 139.19,99.06
MIDI_OUT  (via drill 0.41)
  Top 0.254: v33.02,106.68 32.26,105.92 v32.26,87.38
  Bottom 0.254: v32.26,87.38 34.54,87.38 35.31,86.61 35.31,83.31 37.33,81.29 U1.26 U1.26' | v33.02,106.68 37.34,111 139.19,111 151.13,99.06 153.23,99.06 R8.2
N$1
  Bottom 0.254: LED1.2-DOUT 19.57,62.98 21.07,61.48 LED2.4-DIN
N$2
  Bottom 0.254: LED2.2-DOUT 34.81,62.98 36.31,61.48 LED3.4-DIN
N$3
  Bottom 0.254: LED4.2-DOUT 67.83,62.98 69.33,61.48 LED5.4-DIN
N$4
  Bottom 0.254: LED5.2-DOUT 84.34,62.98 85.84,61.48 LED6.4-DIN
N$5
  Bottom 0.254: LED3.2-DOUT 51.32,62.98 52.82,61.48 LED4.4-DIN
N$6
  Bottom 0.254: LED7.2-DOUT 116.09,62.98 117.59,61.48 LED8.4-DIN
N$7
  Bottom 0.254: LED8.2-DOUT 133.87,62.98 135.37,61.48 LED9.4-DIN
N$8
  Bottom 0.254: J1.TIP 167.04,104.14 164.59,104.14 M.TP R8.1
N$9
  Bottom 0.254: LED11.2-DOUT 18.3,46.47 19.8,44.97 LED12.4-DIN
N$10
  Bottom 0.254: LED9.2-DOUT 150.38,62.98 151.88,61.48 LED10.4-DIN
N$11
  Bottom 0.254: LED6.2-DOUT 100.85,62.98 102.35,61.48 LED7.4-DIN
N$12
  Bottom 0.254: LED14.2-DOUT 67.83,46.47 69.33,44.97 LED15.4-DIN
N$13
  Bottom 0.254: LED15.2-DOUT 84.34,46.47 85.84,44.97 LED16.4-DIN
N$14
  Bottom 0.254: LED13.2-DOUT 51.32,46.47 52.82,44.97 LED14.4-DIN
N$15
  Bottom 0.254: LED17.2-DOUT 116.09,46.47 117.59,44.97 LED18.4-DIN
N$16
  Bottom 0.254: LED18.2-DOUT 133.87,46.47 135.37,44.97 LED19.4-DIN
N$17
  Bottom 0.254: LED19.2-DOUT 150.38,46.47 151.88,44.97 LED20.4-DIN
N$18
  Bottom 0.254: LED16.2-DOUT 100.85,46.47 102.35,44.97 LED17.4-DIN
N$19
  Bottom 0.254: LED12.2-DOUT 34.81,46.47 36.31,44.97 LED13.4-DIN
N$20
  Bottom 0.203: LED21.2-DOUT 18.3,29.96 19.8,28.46 LED22.4-DIN
N$21
  Bottom 0.203: LED22.2-DOUT 34.81,29.96 36.31,28.46 LED23.4-DIN
N$22
  Bottom 0.203: LED24.2-DOUT 67.83,29.96 69.33,28.46 LED25.4-DIN
N$23
  Bottom 0.203: LED25.2-DOUT 84.34,29.96 85.84,28.46 LED26.4-DIN
N$24
  Bottom 0.203: LED23.2-DOUT 51.32,29.96 52.82,28.46 LED24.4-DIN
N$25
  Bottom 0.203: LED27.2-DOUT 116.09,29.96 117.59,28.46 LED28.4-DIN
N$26
  Bottom 0.203: LED28.2-DOUT 133.87,29.96 135.37,28.46 LED29.4-DIN
N$27
  Bottom 0.203: LED31.2-DOUT 17.03,13.45 18.53,11.95 LED32.4-DIN
N$28
  Bottom 0.203: LED29.2-DOUT 150.38,29.96 151.88,28.46 LED30.4-DIN
N$29
  Bottom 0.203: LED26.2-DOUT 100.85,29.96 102.35,28.46 LED27.4-DIN
N$30
  Bottom 0.203: LED35.4-DIN 72.12,11.95 70.62,13.45 LED34.2-DOUT
N$31
  Bottom 0.203: LED35.2-DOUT 87.13,13.45 88.63,11.95 LED36.4-DIN
N$32
  Bottom 0.203: LED33.2-DOUT 47.51,13.45 49.01,11.95 LED34.4-DIN
N$33
  Bottom 0.203: LED37.2-DOUT 119.9,13.45 121.4,11.95 LED38.4-DIN
N$34
  Bottom 0.203: LED38.2-DOUT 136.41,13.45 137.91,11.95 LED39.4-DIN
N$35
  Bottom 0.203: LED39.2-DOUT 153.68,13.45 155.18,11.95 LED40.4-DIN
N$36
  Bottom 0.203: LED36.2-DOUT 103.9,13.45 105.4,11.95 LED37.4-DIN
N$37
  Bottom 0.203: LED32.2-DOUT 31,13.45 32.5,11.95 LED33.4-DIN
N$38
  Bottom 0.254: R7.1 159.26,103.89 3VM.TP 161.29,105.92 170.94,105.92 171.6,105.26 J1.RING1
N$39
  Bottom 0.254: U1.21 U1.21'
N$40
  Bottom 0.254: U1.22' U1.22
N$41
  Bottom 0.254: U1.24' U1.24
N$42
  Bottom 0.254: U1.25' U1.25
N$43
  Bottom 0.203: R2.2 87.7,52.83 87.3,53.23 U3.7
N$44
  Bottom 0.203: U3.5 85.22,54.23 85.85,54.86 C44.1
N$45
  Bottom 0.203: U1.32 U1.32'
N$47
  Bottom 0.254: U6.1 154.94,93.98 156.21,92.71 R9.1 157.8,91.51 158.12,91.19 159.13,91.19 D1.C
N$48  (via drill 0.41)
  Top 0.254: v156.46,94.74 154.94,93.22 154.94,91.44 v154.81,91.31
  Bottom 0.254: U6.2 154.69,91.44 v154.81,91.31 156.46,89.66 D1.A | v156.46,94.74 156.52,94.69 166.33,94.69 J2.TIP
N$49
  Bottom 0.254: J2.RING1 170.84,93.42 168.6,91.19 164.85,91.19 163.32,92.71 R9.2
N$50
  Bottom 0.203: U5.7 87.74,20.21 88.14,19.81 R4.2
N$51
  Bottom 0.203: U5.5 85.13,21.72 85.51,22.1 88.81,22.1 C48.1
N$53
  Bottom 0.203: U1.31 U1.31'
N$54
  Bottom 0.203: U1.29 U1.29'
N$55
  Bottom 0.203: U1.35 U1.35'
N$56
  Bottom 0.203: U1.30 U1.30'
N$57
  Bottom 0.203: C51.1 R12.2 153.25,81.28 | C50.1 153.25,81.28 | 153.25,81.28 150.37,81.28 149.1,82.55 R11.1
N$58
  Bottom 0.203: U1.37 U1.37'
N$61
  Bottom 0.203: U1.2' U1.2
N$62
  Bottom 0.203: U4.7 86.98,36.47 87.38,36.07 R3.2
N$63
  Bottom 0.203: U4.5 85.13,37.63 85.6,38.1 C46.1
N$64
  Bottom 0.203: U1.1' U1.1
N$66
  Bottom 0.203: U1.39 U1.39'
N$67
  Bottom 0.203: U1.16' U1.16
N$114
  Bottom 0.203: U2.5 85.2,71.25 86.85,72.9 C42.1
N$115
  Bottom 0.203: R1.2 89.58,70.87 88.97,70.25 U2.7
NEOPIXEL
  Bottom 0.203: 6.34,61.48 5.84,61.98 5.84,68.58 8.38,71.12 | LED1.4-DIN 6.35,61.48 | NEOPIXEL.TP 3.81,61.47 6.34,61.47 | U1.34' 17.01,72.38 15.75,71.12
  Bottom 0.254: 6.34,61.48 6.35,61.48 6.34,61.47 | U1.34 U1.34' | 15.75,71.12 8.38,71.12
NEOPIXEL0
  Bottom 0.203: LED11.4-DIN 5.32,44.97 3.05,47.24 3.05,52.58 6.35,55.88 81.28,55.88 82.04,56.64 86.87,56.64 87.63,55.88 162.31,55.88 163.83,57.42 163.83,62.23 163.08,62.98 LED10.2-DOUT
NEOPIXEL1
  Bottom 0.203: LED20.2-DOUT 163.08,46.47 163.83,45.72 163.83,39.37
  Bottom 0.254: 163.83,39.37 87.63,39.37 86.3,40.64 82.55,40.64 81.28,39.37 5.33,39.37 2.54,36.58 2.54,29.73 3.81,28.46 LED21.4-DIN
NEOPIXEL2
  Bottom 0.254: LED31.4-DIN 3.29,11.95 2.54,12.7 2.54,20.32 5.08,22.86 81.03,22.86 82.55,24.38 86.11,24.38 87.63,22.86 163.83,23.11 163.83,29.21 163.08,29.96 LED30.2-DOUT
PWM_AUDIO
  Bottom 0.203: U1.17 U1.17' 42.41,106.16 44.2,107.95 134.37,107.95 137.67,104.65 137.67,89.66 144.78,82.55 R11.2
SCL  (via drill 0.39)
  Top 0.203: v83.31,73.15 83.57,73.15 84.07,72.64 84.07,56.65 v82.32,54.9 82.29,54.87 84.03,53.13 84.03,39.18 84.02,39.17 84.02,38.66 | v83.14,38.64 84,38.64 84.02,38.66 | DISP1.3 97.79,91.69 99.31,90.17 99.31,76.96 95.76,73.41 v85.6,73.41 | 84.02,38.66 84.02,23.82 83.06,22.86 v83.06,22.35
  Bottom 0.178: U5.4 84.73,21.99 85.6,22.86 85.6,23.88 84.07,23.88 83.06,22.86 v83.06,22.35
  Bottom 0.203: 57.15,101.53 96.84,101.53 98.55,99.82 98.55,91.69 | U1.20 U1.20' 52.57,103.3 54.33,101.53 57.15,101.53 | v82.32,54.9 83.71,54.9 83.93,54.68 U3.2 | v83.14,38.64 83.18,38.6 83.49,38.6 83.93,38.17 U4.2 | U5.2 83.93,21.99 83.57,22.35 v83.06,22.35 | v83.06,22.35 | R5.2 57.17,101.51 57.15,101.53 | U2.2 83.93,72.54 v83.31,73.15 83.31,73.66 83.82,74.17 85.09,74.17 85.6,73.66 v85.6,73.41
  Bottom 0.254: J4.4 102.87,91.69 98.55,91.69 DISP1.3
SDA  (via drill 0.39)
  Top 0.203: 84.6,56.17 v84.34,55.91 84.6,55.91 | 84.6,56.17 84.6,55.91 | 84.6,55.91 84.6,39.06 | v84.8,39.06 84.6,39.06 | v84.6,23.15 84.6,39.06 | 84.6,73.15 84.6,73.67 85.09,74.17 95.25,74.17 98.3,77.22 98.3,87.12 DISP1.4 | 84.6,73.15 84.6,56.17 | v84.58,73.15 84.6,73.15
  Bottom 0.203: U1.19 U1.19' 47.49,104.89 48.26,105.66 55.88,105.66 | U3.3 84.33,55.9 v84.34,55.91 | U4.3 84.33,38.59 84.73,38.99 | U4.4 84.73,38.99 | 84.73,38.99 v84.8,39.06 | U5.3 84.33,22.86 84.6,23.13 v84.6,23.15 | U2.3 84.33,72.9 v84.58,73.15 | 55.88,105.66 97.79,105.66 99.57,103.89 99.57,93.73 100.58,92.72 J4.3 | R6.2 55.88,105.66
  Bottom 0.254: DISP1.4 103.63,89.15 104.65,90.17 104.65,91.95 103.88,92.72 J4.3
TA1  (via drill 0.41)
  Top 0.203: K1.T2 v17.02,67.31 | 13.97,57.15 15.24,58.42
  Top 1.016: K1.T1 13.97,57.15 | 15.24,58.42 K1.T2
  Bottom 0.203: v17.02,67.31 21.34,71.63 75.69,71.63 77.07,70.25 U2.19
TA2  (via drill 0.41)
  Top 0.203: K2.T2 v33.53,67.31 | 30.48,57.15 31.75,58.42
  Top 1.016: K2.T1 30.48,57.15 | 31.75,58.42 K2.T2
  Bottom 0.203: v33.53,67.31 36.83,70.61 75.69,70.61 76.45,69.85 U2.18
TA3  (via drill 0.41)
  Top 0.203: K3.T2 48.46,67.51 v50.04,67.51
  Top 1.016: K3.T1 48.26,57.15 K3.T2
  Bottom 0.203: v50.04,67.51 51.98,69.45 U2.17
TA4  (via drill 0.39)
  Top 0.203: K4.T2 v66.55,67.31
  Top 1.016: K4.T2 64.77,57.15 K4.T1
  Bottom 0.203: v66.55,67.31 68.29,69.05 U2.16
TA5  (via drill 0.39)
  Top 0.203: 80.01,57.15 81.28,58.42 | v83.31,66.29 83.31,66.55 82.55,67.31 K5.T2
  Top 1.016: 81.28,58.42 K5.T2 | K5.T1 80.01,57.15
  Bottom 0.203: U2.15 83.53,66.51 v83.31,66.29
TA6  (via drill 0.39)
  Top 0.203: 96.52,57.15 97.79,58.42 | v99.69,67.44 97.92,67.44 K6.T2
  Top 1.016: K6.T1 96.52,57.15 | 97.79,58.42 K6.T2
  Bottom 0.203: U2.14 83.93,66.95 84.84,66.04 98.3,66.04 v99.69,67.44
TA7  (via drill 0.39)
  Top 0.203: K7.T2 v116.08,67.31
  Top 1.016: K7.T1 114.3,57.15 K7.T2
  Bottom 0.203: U2.13 84.33,67.31 85.09,66.55 96.77,66.55 99.31,69.09 114.3,69.09 v116.08,67.31
TA8  (via drill 0.39)
  Top 0.203: v132.59,67.56 131.06,67.56 K8.T2 | 129.54,57.15 130.81,58.42
  Top 1.016: K8.T1 129.54,57.15 | 130.81,58.42 K8.T2
  Bottom 0.203: U2.12 84.73,67.67 85.34,67.06 95.76,67.06 98.55,69.85 130.3,69.85 v132.59,67.56
TA9  (via drill 0.39)
  Top 0.203: 146.05,57.15 147.32,58.42 | v148.84,67.82 147.32,67.82 K9.T2
  Top 1.016: K9.T1 146.05,57.15 | 147.32,58.42 K9.T2
  Bottom 0.203: U2.11 85.73,68.45 86.36,67.82 95.25,67.82 98.04,70.61 146.05,70.61 v148.84,67.82
TA10  (via drill 0.39)
  Top 0.203: v165.61,67.56 164.08,67.56 K10.T2 | 162.56,57.15 163.83,58.42
  Top 1.016: K10.T1 162.56,57.15 | 163.83,58.42 K10.T2
  Bottom 0.203: U2.10 86.14,69.05 86.61,68.58 94.74,68.58 97.54,71.37 161.8,71.37 v165.61,67.56
TA11  (via drill 0.39)
  Top 0.203: v169.16,60.96 170.43,60.96 171.45,59.94 TP10.TP
  Bottom 0.203: U2.9 86.51,69.45 87,68.96 94.11,68.96 97.28,72.14 166.12,72.14 169.16,69.09 v169.16,60.96
TA12  (via drill 0.39)
  Top 0.203: v171.45,67.31 TP11.TP
  Bottom 0.203: U2.8 86.87,69.85 87.38,69.34 93.47,69.34 97.03,72.9 167.13,72.9 171.45,68.58 v171.45,67.31
TB1  (via drill 0.39)
  Top 0.254: v17.02,50.8 K11.T2
  Top 1.016: K11.T1 15.24,40.64 K11.T2
  Bottom 0.203: U3.19 19.45,53.23 v17.02,50.8
TB2  (via drill 0.39)
  Top 0.203: v33.53,51 31.95,51 K12.T2
  Top 1.016: K12.T1 31.75,40.64 K12.T2
  Bottom 0.203: U3.18 35.36,52.83 v33.53,51
TB3  (via drill 0.39)
  Top 0.203: v49.78,51.31 48.26,51.31 K13.T2 48.26,41.91 46.99,40.64
  Top 1.016: K13.T1 46.99,40.64
  Bottom 0.203: U3.17 50.91,52.43 v49.78,51.31
TB4  (via drill 0.39)
  Top 0.203: K14.T2 64.94,50.97 v66.67,50.97
  Top 1.016: K14.T1 64.77,40.64 K14.T2
  Bottom 0.203: U3.16 67.74,52.03 v66.67,50.97
TB5  (via drill 0.39)
  Top 0.203: v83.32,49.03 83.32,50.03 82.55,50.8 K15.T2 81.28,41.4 80.77,40.89 | K15.T1 71.37,40.89
  Top 1.016: 71.37,40.89 80.77,40.89
  Bottom 0.203: U3.15 83.53,49.24 v83.32,49.03
TB6  (via drill 0.39)
  Top 0.203: 97.54,40.64 97.79,40.89 | K16.T2 v99.82,50.8
  Top 1.016: K16.T1 97.54,40.64 | 97.79,40.89 K16.T2
  Bottom 0.203: U3.14 83.93,50.18 85.09,49.02 95.76,49.02 97.54,50.8 v99.82,50.8
TB7  (via drill 0.39)
  Top 0.203: 113.54,40.64 114.3,41.4 | K17.T2 114.3,51.05 v116.08,51.05
  Top 1.016: K17.T1 113.54,40.64 | 114.3,41.4 K17.T2
  Bottom 0.203: U3.13 84.33,50.52 85.44,49.4 95.12,49.4 97.54,51.82 115.32,51.82 v116.08,51.05
TB8  (via drill 0.39)
  Top 0.203: v132.59,50.8 K18.T2
  Top 1.016: K18.T1 130.81,40.64 K18.T2
  Bottom 0.203: U3.12 84.73,50.65 85.6,49.78 94.74,49.78 97.54,52.58 130.81,52.58 v132.59,50.8
TB9  (via drill 0.39)
  Top 0.203: v149.1,50.8 K19.T2
  Top 1.016: K19.T1 146.05,40.64 147.32,41.91 K19.T2
  Bottom 0.203: U3.11 85.13,51.02 85.85,50.29 94.49,50.29 97.16,52.96 146.94,52.96 v149.1,50.8
TB10  (via drill 0.39)
  Top 0.203: 162.56,40.64 163.83,41.91 | K20.T2 v165.61,50.8
  Top 1.016: K20.T1 162.56,40.64 | 163.83,41.91 K20.T2
  Bottom 0.203: U3.10 85.73,51.52 86.49,50.76 94.2,50.76 97.03,53.59 162.81,53.59 v165.61,50.8
TB11  (via drill 0.39)
  Top 0.203: v168.91,48.26 170.18,48.26 171.45,46.99 TP12.TP
  Bottom 0.203: U3.9 86.25,52.43 87.38,51.31 93.47,51.31 96.39,54.23 167.26,54.23 168.91,52.58 v168.91,48.26
TB12  (via drill 0.39)
  Top 0.203: v171.45,54.61 TP13.TP
  Bottom 0.203: U3.8 86.61,52.83 87.75,51.69 92.57,51.69 95.74,54.86 171.2,54.86 v171.45,54.61
TC1  (via drill 0.39)
  Top 0.203: K21.T2 15.24,34.54 15.49,34.8 v16.76,34.8 | 13.97,24.13 15.24,25.4
  Top 1.016: K21.T1 13.97,24.13 | 15.24,25.4 K21.T2
  Bottom 0.203: v16.76,34.8 18.8,36.83 77.72,36.83 78.09,36.47 U4.19
TC2  (via drill 0.39)
  Top 0.203: v33.53,34.54 31.75,34.54 K22.T2
  Top 1.016: K22.T1 31.75,24.13 K22.T2
  Bottom 0.203: v33.53,34.54 35.31,36.32 77.47,36.32 77.72,36.07 U4.18
TC3  (via drill 0.39)
  Top 0.203: K23.T2 48.44,34.47 v50.04,34.47
  Top 1.016: K23.T1 48.26,24.13 K23.T2
  Bottom 0.203: U4.17 77.36,35.67 77.09,35.94 51.51,35.94 v50.04,34.47
TC4  (via drill 0.39)
  Top 0.203: K24.T2 64.94,34.45 v66.8,34.45 | 63.5,24.13 64.77,25.4
  Top 1.016: K24.T1 63.5,24.13 | 64.77,25.4 K24.T2
  Bottom 0.203: U4.16 67.61,35.27 v66.8,34.45
TC5  (via drill 0.39)
  Top 0.203: v83.31,32.51 83.31,33.78 82.8,34.29 K25.T2 | 80.01,24.13 81.28,25.4
  Top 1.016: K25.T1 80.01,24.13 | 81.28,25.4 K25.T2
  Bottom 0.203: U4.15 83.53,32.73 v83.31,32.51
TC6  (via drill 0.39)
  Top 0.203: 96.52,24.13 97.79,25.4 | K26.T2 v100.84,34.29
  Top 1.016: K26.T1 96.52,24.13 | 97.79,25.4 K26.T2
  Bottom 0.203: v100.84,34.29 100.84,34.04 99.06,32.26 85.31,32.26 83.93,33.64 U4.14
TC7  (via drill 0.39)
  Top 0.203: v116.08,34.29 K27.T2 | K27.T1 104.65,24.64 | 113.79,24.64 114.3,25.15
  Top 1.016: 104.65,24.64 113.79,24.64 | 114.3,25.15 K27.T2
  Bottom 0.203: U4.13 84.33,33.78 85.34,32.77 97.28,32.77 100.08,35.56 114.81,35.56 v116.08,34.29
TC8  (via drill 0.39)
  Top 0.203: v133.35,35.31 131.83,35.31 K28.T2 | K28.T1 120.9,24.38 | 130.3,24.38 130.81,24.89
  Top 1.016: 120.9,24.38 130.3,24.38 | 130.81,24.89 K28.T2
  Bottom 0.203: U4.12 84.73,34.14 85.6,33.27 95.76,33.27 98.55,36.07 132.59,36.07 v133.35,35.31
TC9  (via drill 0.39)
  Top 0.203: v149.86,35.05 148.08,35.05 K29.T2
  Top 1.016: K29.T1 147.32,24.13 K29.T2
  Bottom 0.203: U4.11 85.13,34.41 85.76,33.78 95.25,33.78 98.04,36.58 148.34,36.58 v149.86,35.05
TC10  (via drill 0.39)
  Top 0.203: v166.37,35.05 164.59,35.05 K30.T2
  Top 1.016: K30.T1 163.83,24.13 K30.T2
  Bottom 0.203: U4.10 86.14,35.27 87.12,34.29 93.98,34.29 97.03,37.34 164.34,37.34 166.37,35.31 v166.37,35.05
TC11  (via drill 0.39)
  Top 0.203: v168.91,27.69 170.69,27.69 171.45,26.92 TP14.TP
  Bottom 0.203: U4.9 86.51,35.67 87.5,34.67 92.81,34.67 95.98,37.85 167.39,37.85 168.91,36.32 v168.91,27.69
TC12  (via drill 0.39)
  Top 0.203: v171.45,34.29 TP15.TP
  Bottom 0.203: U4.8 86.84,36.07 87.85,35.05 92.2,35.05 95.5,38.35 168.18,38.35 171.45,35.08 v171.45,34.29
TD1  (via drill 0.39)
  Top 0.203: K31.T2 v17.02,17.78
  Top 1.016: K31.T1 15.24,7.62 K31.T2
  Bottom 0.203: v17.02,17.78 20.07,20.83 74.42,20.83 75.04,20.21 U5.19
TD2  (via drill 0.39)
  Top 0.203: K32.T2 v33.53,17.78
  Top 1.016: K32.T1 31.75,7.62 K32.T2
  Bottom 0.203: v33.53,17.78 36.07,20.32 73.66,20.32 74.17,19.81 U5.18
TD3  (via drill 0.39)
  Top 0.203: K33.T2 v50.04,17.78 | 46.99,7.62 48.26,8.89
  Top 1.016: K33.T1 46.99,7.62 | 48.26,8.89 K33.T2
  Bottom 0.203: v50.04,17.78 51.67,19.41 U5.17
TD4  (via drill 0.39)
  Top 0.203: K34.T2 v66.55,17.78 | 63.5,7.62 64.77,8.89
  Top 1.016: K34.T1 63.5,7.62 | 64.77,8.89 K34.T2
  Bottom 0.203: U5.16 67.78,19.01 v66.55,17.78
TD5  (via drill 0.39)
  Top 0.203: 80.01,7.62 81.28,8.89 | v83.31,15.75 83.31,17.02 82.55,17.78 K35.T2
  Top 1.016: K35.T1 80.01,7.62 | 81.28,8.89 K35.T2
  Bottom 0.203: U5.15 83.53,15.96 v83.31,15.75
TD6  (via drill 0.39)
  Top 0.203: 96.52,7.62 97.79,8.89 | v99.57,17.78 K36.T2
  Top 1.016: K36.T1 96.52,7.62 | 97.79,8.89 K36.T2
  Bottom 0.203: U5.14 83.93,16.4 85.09,15.24 97.03,15.24 v99.57,17.78
TD7  (via drill 0.39)
  Top 0.203: v116.08,17.78 K37.T2
  Top 1.016: K37.T1 114.3,7.62 K37.T2
  Bottom 0.203: v116.08,17.78 114.55,19.3 100.09,19.3 96.54,15.75 85.34,15.75 84.33,16.76 U5.13
TD8  (via drill 0.39)
  Top 0.203: v132.59,17.78 K38.T2
  Top 1.016: K38.T1 130.81,7.62 K38.T2
  Bottom 0.203: v132.59,17.78 130.68,19.68 99.94,19.68 96.78,16.52 85.11,16.52 84.73,16.9 U5.12
TD9  (via drill 0.39)
  Top 0.203: v149.1,17.78 K39.T2
  Top 1.016: K39.T1 147.32,7.62 K39.T2
  Bottom 0.203: U5.11 85.13,17.23 85.34,17.02 96.73,17.02 99.78,20.07 146.81,20.07 v149.1,17.78
TD10  (via drill 0.39)
  Top 0.203: v166.12,17.78 K40.T2
  Top 1.016: K40.T1 163.83,7.62 K40.T2
  Bottom 0.203: U5.10 87.21,17.53 96.7,17.53 99.62,20.45 163.45,20.45 v166.12,17.78
TD11  (via drill 0.39)
  Top 0.203: v168.91,15.24 170.18,15.24 171.45,13.97 TP16.TP
  Bottom 0.203: U5.9 86.73,19.41 87.98,18.16 96.65,18.16 99.57,21.08 165.61,21.08 168.91,17.78 v168.91,15.24
TD12  (via drill 0.39)
  Top 0.203: v171.45,21.59 TP17.TP
  Bottom 0.203: U5.8 86.87,19.81 88.14,18.54 95.5,18.54 98.81,21.84 171.2,21.84 v171.45,21.59
TP1  (via drill 0.39)
  Top 0.203: TP1.TP v62.23,75.95
  Bottom 0.203: v62.23,75.95 62.1,76.07 61.38,76.8 | 61.38,76.8 56.9,81.28 45.21,81.28 37.85,88.65 23.11,88.65 18.53,93.23 12.18,93.23 9.39,96.02 U1.4 U1.4' | R14.2 61.38,76.8
TP2  (via drill 0.39)
  Top 0.203: TP2.TP v68.58,75.95
  Bottom 0.203: 67.73,76.8 62.74,81.79 45.97,81.79 38.1,89.66 23.37,89.66 19.16,93.86 14.09,93.86 11.93,96.02 U1.5 U1.5' | R15.2 67.73,76.8 | 67.73,76.8 67.82,76.71 v68.58,75.95
TP3  (via drill 0.39)
  Top 0.203: TP3.TP v74.93,75.95
  Bottom 0.203: 74.08,76.8 68.58,82.3 46.74,82.3 38.35,90.68 23.62,90.68 19.81,94.49 16,94.49 14.47,96.02 U1.6 U1.6' | v74.93,75.95 74.8,76.07 74.08,76.8 | R16.2 74.08,76.8
TP4  (via drill 0.39)
  Top 0.203: TP4.TP v81.28,75.95
  Bottom 0.203: U1.7' U1.7 17.01,96.02 17.78,95.25 20.57,95.25 24.38,91.44 38.86,91.44 47.5,82.8 74.42,82.8 v81.28,75.95 80.43,76.8 R17.2
TP5  (via drill 0.39)
  Top 0.203: TP5.TP v87.63,75.95
  Bottom 0.203: 86.78,76.8 80.26,83.31 48.26,83.31 39.12,92.46 25.15,92.46 22.09,95.52 U1.9 U1.9' | v87.63,75.95 87.5,76.07 86.78,76.8 | R18.2 86.78,76.8
TP6  (via drill 0.39)
  Top 0.203: TP6.TP v93.98,75.95
  Bottom 0.203: v93.98,75.95 93.85,76.07 93.13,76.8 | 93.13,76.8 86.11,83.82 49.28,83.82 39.62,93.47 25.91,93.47 24.63,94.75 U1.10 U1.10' | R19.2 93.13,76.8
TP7  (via drill 0.39)
  Top 0.203: v112.01,86.36 TP7.TP
  Bottom 0.203: U1.11' U1.11 27.17,94.75 27.94,93.98 53.34,93.98 55.37,91.95 55.37,88.14 59.18,84.33 106.43,84.33 | 106.43,84.33 109.98,84.33 v112.01,86.36 | R20.2 106.26,84.16 106.43,84.33
TP8  (via drill 0.39)
  Top 0.203: v112.01,92.71 TP8.TP
  Bottom 0.203: U1.12' U1.12 29.71,96.02 30.48,95.25 53.59,95.25 56.39,92.46 56.39,88.14 59.69,84.84 108.2,84.84 112.01,88.65 | 112.01,88.65 v112.01,92.71 | R21.2 111.76,82.55 113.03,83.82 113.03,87.63 112.01,88.65
TP9  (via drill 0.39)
  Top 0.203: v112.01,99.06 TP9.TP
  Bottom 0.203: U1.14' U1.14 34.79,97.29 35.56,96.52 55.12,96.52 57.15,94.49 57.15,88.14 59.94,85.34 106.93,85.34 110.49,88.9 110.49,97.54 v112.01,99.06 112.14,99.19 112.14,102.83 110.83,104.14 R22.2

## Text on the board
tPlace: picotouch_grid | OUT | MIDI | IN | AUDIO | @todbot
bPlace: picotouch_grid - / capsense touch grid keyboard / for Raspberry Pi Pico | optional I2C OLED display / optional LiPo battery BFF / U2-U5 - MPR121 / U6 - HL11MS / D1 - 1N1418 / R1-R4 - 75k 1% / R7 - 30, R8 - 10, R5,R6,R10 - 4.7k / R14-R17 - 1M / C1-C50 - 100n, C51 - 47uF / LED1-LED40 - SK6812MINI-E (rev. mount) | https://github.com/todbot/picotouch - 7 Apr 2023 - @todbot | picotouch_grid_socket_mpr2
bNames: GND | Qwiic / / StemmaQT | 3V | MIDI OUT | SCL | SDA | MIDI IN | Raspberry Pi Pico | AUDIO OUT | JLCJLCJLCJLC